# Altium schematic sheet Ethernet.SchDoc: Ethernet PHY with RJ45 connector
size A4; Author: A.B; CompanyName: STMicroelectronics; Address1: 12, Rue Jules HOROWITZ; Address2: 38019 Grenoble; Address3: FRANCE; DocumentNumber: MB1137; Revision: B-01; SheetNumber: 5; SheetTotal: 6; Project: NUCLEO-XXXXZX
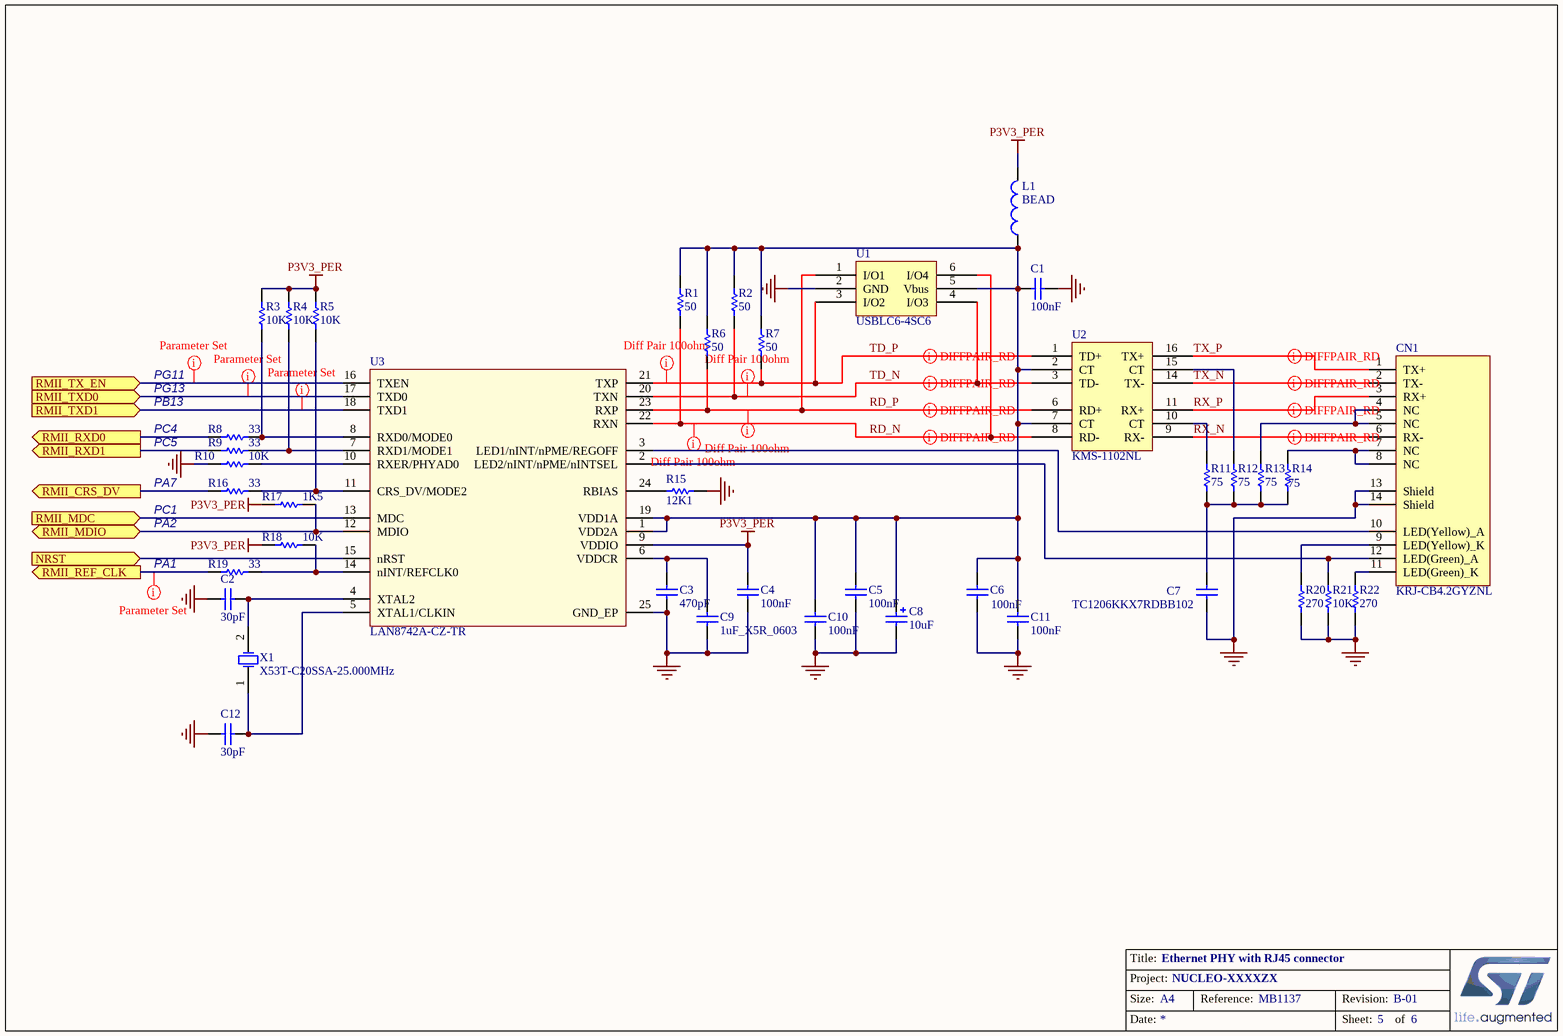
[diagram p0: Ethernet.SchDoc]

## Parts
C1  100nF  [0603C]
C2  30pF  [0603C]
C3  470pF  [0603C]
C4  100nF  [0603C]
C5  100nF  [0603C]
C6  100nF  [0603C]
C7  TC1206KKX7RDBB102  [1206C]
C8  10uF  [TAN-A]
C9  1uF_X5R_0603  [0603C]
C10  100nF  [0603C]
C11  100nF  [0603C]
C12  30pF  [0603C]
CN1  KRJ-CB4.2GYZNL  [RJ45_KRJ-CB4.2GYZNL]
L1  BEAD  [0603L]
R1  50  [0603R]
R2  50  [0603R]
R3  10K  [0603R]
R4  10K  [0603R]
R5  10K  [0603R]
R6  50  [0603R]
R7  50  [0603R]
R8  33  [0603R]
R9  33  [0603R]
R10  10K  [0603R]
R11  75  [0603R]
R12  75  [0603R]
R13  75  [0603R]
R14  75  [0603R]
R15  12K1  [0603R]
R16  33  [0603R]
R17  1K5  [0603R]
R18  10K  [0603R]
R19  33  [0603R]
R20  270  [0603R]
R21  10K  [0603R]
R22  270  [0603R]
U1  USBLC6-4SC6  [SOT23-6L]
U2  KMS-1102NL  [Transformer]
U3  LAN8742A-CZ-TR  [QFN24_0R5_4X4]
X1  X53T-C20SSA-25.000MHz  [XTAL_2SM_5R0X3R2]

## Ports
NRST (in), RMII_CRS_DV (out), RMII_MDC (in), RMII_MDIO (bidir), RMII_REF_CLK (out), RMII_RXD0 (out), RMII_RXD1 (out), RMII_TX_EN (in), RMII_TXD0 (in), RMII_TXD1 (in)

## Nets
GND: C1.1 C2.2 C3.1 C4.1 C5.1 C6.1 C7.1 C8.2 C9.2 C10.1 C11.1 C12.2 CN1.13(Shield) CN1.14(Shield) R10.2 R15.2 R20.2 R21.2 R22.2 U1.2(GND) U3.25(GND_EP)
P3V3_PER: C4.2 L1.2 R3.1 R4.1 R5.1 R17.2 R18.1 U3.9(VDDIO)
NRST: U3.15(nRST) ; port NRST
RD_N: R1.1 U1.6(I/O4) U2.8(RD-) U3.22(RXN)
RD_P: R6.1 U1.1(I/O1) U2.6(RD+) U3.23(RXP)
RMII_CRS_DV: R16.2 ; port RMII_CRS_DV
RMII_MDC: U3.13(MDC) ; port RMII_MDC
RMII_MDIO: R17.1 U3.12(MDIO) ; port RMII_MDIO
RMII_REF_CLK: R19.2 ; port RMII_REF_CLK
RMII_RXD0: R8.2 ; port RMII_RXD0
RMII_RXD1: R9.2 ; port RMII_RXD1
RMII_TX_EN: U3.16(TXEN) ; port RMII_TX_EN
RMII_TXD0: U3.17(TXD0) ; port RMII_TXD0
RMII_TXD1: U3.18(TXD1) ; port RMII_TXD1
RX_N: CN1.6(RX-) U2.9(RX-)
RX_P: CN1.3(RX+) U2.11(RX+)
TD_N: R2.1 U1.4(I/O3) U2.3(TD-) U3.20(TXN)
TD_P: R7.1 U1.3(I/O2) U2.1(TD+) U3.21(TXP)
TX_N: CN1.2(TX-) U2.14(TX-)
TX_P: CN1.1(TX+) U2.16(TX+)
NetC1_2: C1.2 C5.2 C6.2 C8.1 C10.2 C11.2 L1.1 R1.2 R2.2 R6.2 R7.2 U1.5(Vbus) U2.2(CT) U2.7(CT) U3.1(VDD2A) U3.19(VDD1A)
NetC2_1: C2.1 U3.4(XTAL2) X1.2(OSC2)
NetC3_2: C3.2 C9.1 U3.6(VDDCR)
NetC7_2: C7.2 R11.1 R12.1 R13.1 R14.1
NetC12_1: C12.1 U3.5(XTAL1/CLKIN) X1.1(OSC1)
NetCN1_4: CN1.4(NC) CN1.5(NC) R13.2
NetCN1_7: CN1.7(NC) CN1.8(NC) R14.2
NetCN1_9: CN1.9(LED(Yellow)_K) R20.1
NetCN1_10: CN1.10(LED(Yellow)_A) U3.3(LED1/nINT/nPME/REGOFF)
NetCN1_11: CN1.11(LED(Green)_K) R22.1
NetCN1_12: CN1.12(LED(Green)_A) R21.1 U3.2(LED2/nINT/nPME/nINTSEL)
NetR3_2: R3.2 R8.1 U3.8(RXD0/MODE0)
NetR4_2: R4.2 R9.1 U3.7(RXD1/MODE1)
NetR5_2: R5.2 R16.1 U3.11(CRS_DV/MODE2)
NetR10_1: R10.1 U3.10(RXER/PHYAD0)
NetR11_2: R11.2 U2.10(CT)
NetR12_2: R12.2 U2.15(CT)
NetR15_1: R15.1 U3.24(RBIAS)
NetR18_2: R18.2 R19.1 U3.14(nINT/REFCLK0)

## Layout directives
differential pair: RD_N, RD_P, RX_N, RX_P, TD_N, TD_P, TX_N, TX_P
mark named Diff Pair 100ohm: RD_N, RD_P, TD_N, TD_P
rule Matched Net Lengths [Tolerance = 2mm]: RMII_REF_CLK, RMII_TX_EN, RMII_TXD0, RMII_TXD1

## Notes on the sheet
- PG11
- PG13
- PB13
- PC4
- PC5
- PA7
- PC1
- PA2
- PA1
- Title:
- Project:
- Size:
- Date:
- A4
- Reference:
- Sheet:
- Revision:
- of

## Library data of the parts
C1 C4-C6 C10 C11 = Capacitor_ST: Capacitor 0402 / 0603 / 0805; Revision: July-2002: Re-released for DXP Platform.; Value: 100nF
C2 C3 C12 = Capacitor_ST: Capacitor 0402 / 0603 / 0805; Value: 100nF; Revision: July-2002: Re-released for DXP Platform.
C7 = Capacitor_ST: Capacitor 0402 / 0603 / 0805/ 1206; Value: 100nF; Revision: July-2002: Re-released for DXP Platform.
C8 = Cap_10uF_POL_10%_TANA: Polarized Capacitor,10uF,10V,10%,typeA,VISHAY; Manuf_Part_1: 293D106X9010A2TE3; Revision: July-2002: Re-released for DXP Platform.; Value: 10uF; Manuf_1: VISHAY; Order: *; ECCN_US/EU: n/a
C9 = CAP SMD 0603  X5R 1µF 25V 10%: 0603  X5R 1µF; Rated voltage: 25V; Tolerance: 10%; Manufacturer: *; Manufacturer P/N: *; Order code Farnell: 1288202RL; Value: 1µF; Power: *; Technology: X5R; Temperature  Factor: *; Temperature Max: +125°C; Temperature Min: -55°C; STS Code: *
CN1 = KRJ-CB4.2GYZNL: 100 Base-TX (Fast Ethernet) SMD RJ45 single port (1x1) with LEDS Integrated Magnetics Connector; Manuf_1: HanRun; Manuf_Part_1: HR961160C; Manuf_2: Pulse Electronics Corporation; Manuf_Part_2: J3011G21DNLT; Manuf_3: K.O.D International Holding; Manuf_Part_3: RMT-119A-12F6-GY-04; Distrib: Sub Co; Order: *
L1 = Inductor: Value: 100uH; Published: 8-Jun-2000; Revision: July-2002: Re-released for DXP Platform.; Publisher: Altium Limited
R1 R2 R6 R7 = Res_50_1%_0603: Resistor,50,0603,1%,YAGEO; Manuf_Part_1: RC0402FR-0750RL; Value: 50; Manuf_1: YAGEO; Order: *; ECCN_US/EU: n/a; Distrib: FARNELL
R3-R5 R10 R18 R21 = Resistor_ST: Resistor 0402 / 0603 / 0805; Value: 10K
R8 R9 R16 R19 = Res_33_1%_0402: Resistor,33,0402,1%,YAGEO; Manuf_Part_1: RC0402FR-0733RL; Value: 33; Manuf_1: YAGEO; Order: *; ECCN_US/EU: n/a; Distrib: FARNELL
R11-R14 = Res_75_1%_0603: Resistor,75,0603,1%,YAGEO; Manuf_Part_1: RC0402FR-0750RL; Value: 50; Manuf_1: YAGEO; Order: *; ECCN_US/EU: n/a; Distrib: FARNELL
R15 = Res_12K1_1%_0603: Resistor,12K1,0603,1%,VISHAY; Manuf_Part_1: MCT 0603-50 1% P5 12K1; Order: 2325243; Value: 12K1; ECCN_US/EU: n/a; Manuf_1: VISHAY; Distrib: FARNELL
R17 = Res_1K5_1%_0402: Resistor,1K5,0402,1%,YAGEO; Manuf_Part_1: RC0402FR-071K5L; Value: 1K5; Manuf_1: YAGEO; Order: RC0402FR-071K5L; ECCN_US/EU: n/a; Distrib: FARNELL
R20 R22 = Resistor_ST: Resistor 0402 / 0603 / 0805; Value: 10K
U3 = LAN8742A-CZ-TR: LAN8742A-CZ-TR - Small Footprint RMII 10/100 Ethernet, Transceiver with HP Auto-MDIX and flexPWR Technology SQFN-24; Manuf_1: MICROCHIP; Order: LAN8742A-CZ-TR; Manuf_Part_1: LAN8742A-CZ-TR; Distrib: MICROCHIP
X1 = XTAL_5032: Crystal Oscillator; Published: 8-Jun-2000; LatestRevisionDate: 17-Jul-2002; LatestRevisionNote: Re-released for DXP Platform.; PackageReference: R38; Publisher: Altium Limited